# Altium schematic sheet Part E.SchDoc
size A4; SheetNumber: 12; SheetTotal: 16
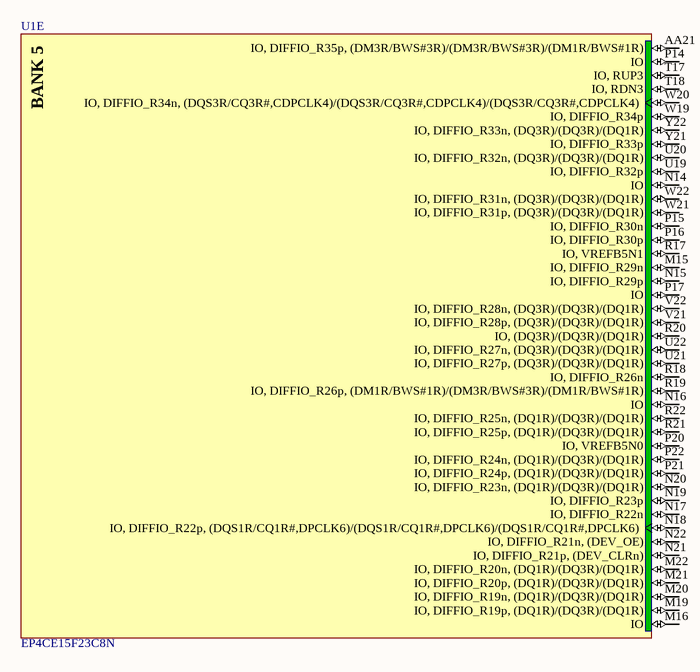
[diagram p0: Part E.SchDoc]

## Parts
U1  EP4CE15F23C8N  [FBGA484_A-240]  (part E of 13)

## Nets

Not connected (* = marked no-connect by the designer): U1 AA21(IO,_DIFFIO_R35p,_(DM3R/BWS#3R)/(DM3R/BWS#3R)/(DM1R/BWS#1R)) M15(IO,_DIFFIO_R29n) M16(IO) M19(IO,_DIFFIO_R19p,_(DQ1R)/(DQ3R)/(DQ1R)) M20(IO,_DIFFIO_R19n,_(DQ1R)/(DQ3R)/(DQ1R)) M21(IO,_DIFFIO_R20p,_(DQ1R)/(DQ3R)/(DQ1R)) M22(IO,_DIFFIO_R20n,_(DQ1R)/(DQ3R)/(DQ1R)) N14(IO) N15(IO,_DIFFIO_R29p) N16(IO) N17(IO,_DIFFIO_R22n) N18(IO,_DIFFIO_R22p,_(DQS1R/CQ1R#,DPCLK6)/(DQS1R/CQ1R#,DPCLK6)/(DQS1R/CQ1R#,DPCLK6)) N19(IO,_DIFFIO_R23p) N20(IO,_DIFFIO_R23n,_(DQ1R)/(DQ3R)/(DQ1R)) N21(IO,_DIFFIO_R21p,_(DEV_CLRn)) N22(IO,_DIFFIO_R21n,_(DEV_OE)) P14(IO) P15(IO,_DIFFIO_R30n) P16(IO,_DIFFIO_R30p) P17(IO) P20(IO,_VREFB5N0) P21(IO,_DIFFIO_R24p,_(DQ1R)/(DQ3R)/(DQ1R)) P22(IO,_DIFFIO_R24n,_(DQ1R)/(DQ3R)/(DQ1R)) R17(IO,_VREFB5N1) R18(IO,_DIFFIO_R26n) R19(IO,_DIFFIO_R26p,_(DM1R/BWS#1R)/(DM3R/BWS#3R)/(DM1R/BWS#1R)) R20(IO,_(DQ3R)/(DQ3R)/(DQ1R)) R21(IO,_DIFFIO_R25p,_(DQ1R)/(DQ3R)/(DQ1R)) R22(IO,_DIFFIO_R25n,_(DQ1R)/(DQ3R)/(DQ1R)) T17(IO,_RUP3) T18(IO,_RDN3) U19(IO,_DIFFIO_R32p) U20(IO,_DIFFIO_R32n,_(DQ3R)/(DQ3R)/(DQ1R)) U21(IO,_DIFFIO_R27p,_(DQ3R)/(DQ3R)/(DQ1R)) U22(IO,_DIFFIO_R27n,_(DQ3R)/(DQ3R)/(DQ1R)) V21(IO,_DIFFIO_R28p,_(DQ3R)/(DQ3R)/(DQ1R)) V22(IO,_DIFFIO_R28n,_(DQ3R)/(DQ3R)/(DQ1R)) W19(IO,_DIFFIO_R34p) W20(IO,_DIFFIO_R34n,_(DQS3R/CQ3R#,CDPCLK4)/(DQS3R/CQ3R#,CDPCLK4)/(DQS3R/CQ3R#,CDPCLK4)) W21(IO,_DIFFIO_R31p,_(DQ3R)/(DQ3R)/(DQ1R)) W22(IO,_DIFFIO_R31n,_(DQ3R)/(DQ3R)/(DQ1R)) Y21(IO,_DIFFIO_R33p) Y22(IO,_DIFFIO_R33n,_(DQ3R)/(DQ3R)/(DQ1R))

## Notes on the sheet
- (in symbol FPGA_EP4CE15F23C8N, part E) BANK 5

## Library data of the parts
U1 = FPGA_EP4CE15F23C8N: Cyclone IV Family FPGA, 1.2V Core, 343 I/O Pins, 4 PLLs, 484-Pin FBGA, Speed Grade 8, Commercial Grade, Pb-Free; Manufacturer: Altera; PackageVersion: ver1.0, Jun-2011; PackageReference: FBGA484_A-240; ComponentLink3URL: http://www.altera.com/literature/lit-dp.jsp?category=cyc%204&showspreadsheet=y; ComponentLink1Description: Manufacturer URL; DatasheetVersion: ver1.6, Nov-2011; ComponentLink3Description: Pinout; ComponentLink2URL: http://www.altera.com/literature/hb/cyclone-iv/cyclone4-handbook.pdf; ComponentLink1URL: http://www.altera.com/; ComponentLink2Description: Handbook; PackageDescription: 484-Pin FineLine Ball Grid Array (FBGA) - Wire Bond - A:2.40; Code_JEDEC: MS-034-AAJ-1; ComponentLink4URL: http://www.altera.com/devicepackaging/04R00247-02.pdf; ComponentLink4Description: Package Specification